# Altium schematic sheet AFE_32_SUP.SchDoc: FMC ADC 128CH 10B
size 420 x 297 mm; Author: G.Kasprowicz; CompanyName: WUT ISE; DrawnBy: G.Kasprowicz; Organization: WUT ISE; Address1: PW ISE; Address2: Nowowiejska 15/19 00-665 Warsaw; Address3: gkasprow@gmail.com; DocumentNumber: 3; Revision: 1; SheetNumber: 3; SheetTotal: 9; ModifiedBy: -; CheckedDate: -; Title2: AFE 32 SUP; DivGrp: WUT ISE; Designer: G.Kasprowicz; ModifiedDate: -; ProjectName: Sensor Box
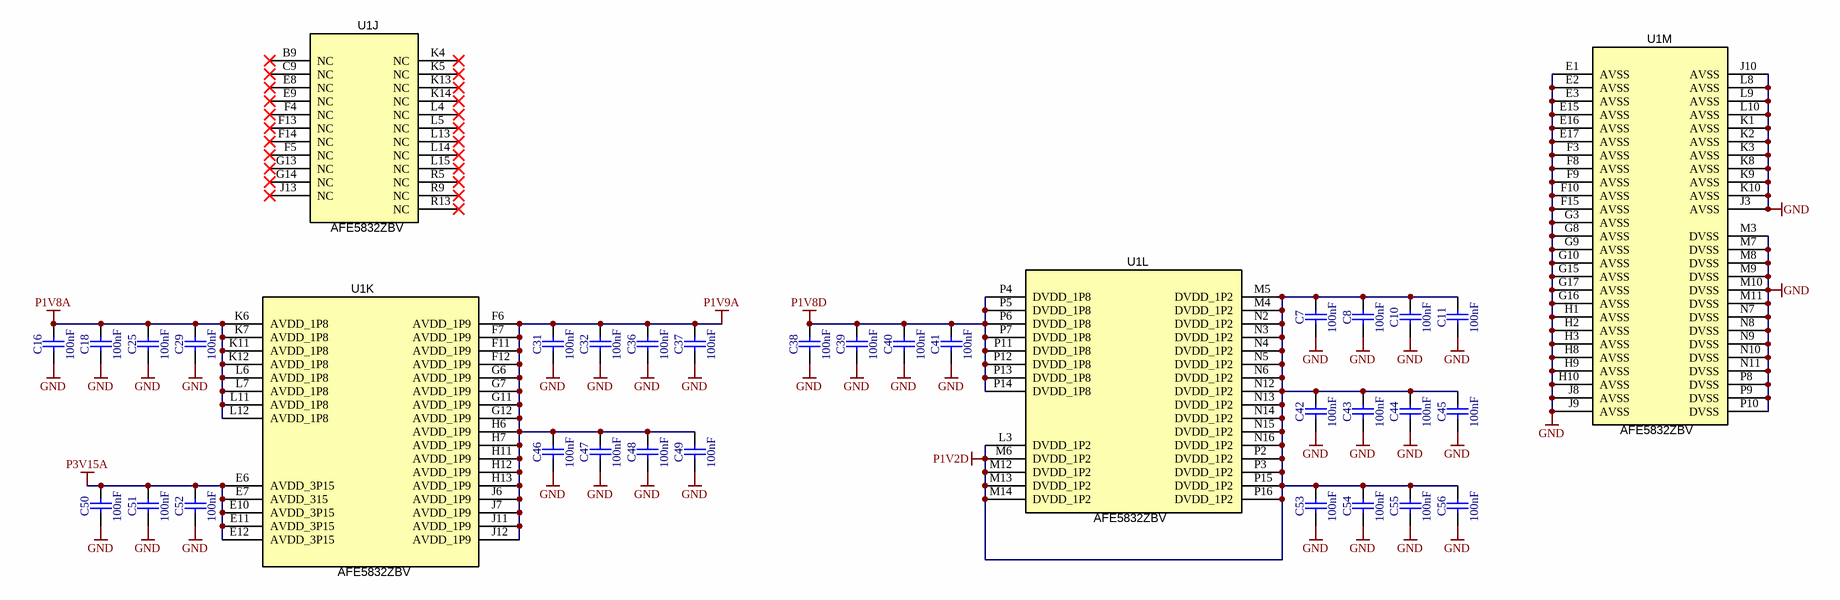
[diagram p0: AFE_32_SUP.SchDoc]

## Parts
C7  100nF  [CAPC0603X33N]
C8  100nF  [CAPC0603X33N]
C10  100nF  [CAPC0603X33N]
C11  100nF  [CAPC0603X33N]
C16  100nF  [CAPC0603X33N]
C18  100nF  [CAPC0603X33N]
C25  100nF  [CAPC0603X33N]
C29  100nF  [CAPC0603X33N]
C31  100nF  [CAPC0603X33N]
C32  100nF  [CAPC0603X33N]
C36  100nF  [CAPC0603X33N]
C37  100nF  [CAPC0603X33N]
C38  100nF  [CAPC0603X33N]
C39  100nF  [CAPC0603X33N]
C40  100nF  [CAPC0603X33N]
C41  100nF  [CAPC0603X33N]
C42  100nF  [CAPC0603X33N]
C43  100nF  [CAPC0603X33N]
C44  100nF  [CAPC0603X33N]
C45  100nF  [CAPC0603X33N]
C46  100nF  [CAPC0603X33N]
C47  100nF  [CAPC0603X33N]
C48  100nF  [CAPC0603X33N]
C49  100nF  [CAPC0603X33N]
C50  100nF  [CAPC0603X33N]
C51  100nF  [CAPC0603X33N]
C52  100nF  [CAPC0603X33N]
C53  100nF  [CAPC0603X33N]
C54  100nF  [CAPC0603X33N]
C55  100nF  [CAPC0603X33N]
C56  100nF  [CAPC0603X33N]
U1  AFE5832ZBV  [BGA289C80P17X17_1500X1500X140]  (parts J,K,L,M of 13)

## Nets
GND: C7.1 C8.1 C10.1 C11.1 C16.1 C18.1 C25.1 C29.1 C31.1 C32.1 C36.1 C37.1 C38.1 C39.1 C40.1 C41.1 C42.1 C43.1 C44.1 C45.1 C46.1 C47.1 C48.1 C49.1 C50.1 C51.1 C52.1 C53.1 C54.1 C55.1 C56.1 U1.E1(AVSS) U1.E2(AVSS) U1.E3(AVSS) U1.E15(AVSS) U1.E16(AVSS) U1.E17(AVSS) U1.F3(AVSS) U1.F8(AVSS) U1.F9(AVSS) U1.F10(AVSS) U1.F15(AVSS) U1.G3(AVSS) U1.G8(AVSS) U1.G9(AVSS) U1.G10(AVSS) U1.G15(AVSS) U1.G16(AVSS) U1.G17(AVSS) U1.H1(AVSS) U1.H2(AVSS) U1.H3(AVSS) U1.H8(AVSS) U1.H9(AVSS) U1.H10(AVSS) U1.J3(AVSS) U1.J8(AVSS) U1.J9(AVSS) U1.J10(AVSS) U1.K1(AVSS) U1.K2(AVSS) U1.K3(AVSS) U1.K8(AVSS) U1.K9(AVSS) U1.K10(AVSS) U1.L8(AVSS) U1.L9(AVSS) U1.L10(AVSS) U1.M3(DVSS) U1.M7(DVSS) U1.M8(DVSS) U1.M9(DVSS) U1.M10(DVSS) U1.M11(DVSS) U1.N7(DVSS) U1.N8(DVSS) U1.N9(DVSS) U1.N10(DVSS) U1.N11(DVSS) U1.P8(DVSS) U1.P9(DVSS) U1.P10(DVSS)
P1V2D: C7.2 C8.2 C10.2 C11.2 C42.2 C43.2 C44.2 C45.2 C53.2 C54.2 C55.2 C56.2 U1.L3(DVDD_1P2) U1.M4(DVDD_1P2) U1.M5(DVDD_1P2) U1.M6(DVDD_1P2) U1.M12(DVDD_1P2) U1.M13(DVDD_1P2) U1.M14(DVDD_1P2) U1.N2(DVDD_1P2) U1.N3(DVDD_1P2) U1.N4(DVDD_1P2) U1.N5(DVDD_1P2) U1.N6(DVDD_1P2) U1.N12(DVDD_1P2) U1.N13(DVDD_1P2) U1.N14(DVDD_1P2) U1.N15(DVDD_1P2) U1.N16(DVDD_1P2) U1.P2(DVDD_1P2) U1.P3(DVDD_1P2) U1.P15(DVDD_1P2) U1.P16(DVDD_1P2)
P1V8A: C16.2 C18.2 C25.2 C29.2 U1.K6(AVDD_1P8) U1.K7(AVDD_1P8) U1.K11(AVDD_1P8) U1.K12(AVDD_1P8) U1.L6(AVDD_1P8) U1.L7(AVDD_1P8) U1.L11(AVDD_1P8) U1.L12(AVDD_1P8)
P1V8D: C38.2 C39.2 C40.2 C41.2 U1.P4(DVDD_1P8) U1.P5(DVDD_1P8) U1.P6(DVDD_1P8) U1.P7(DVDD_1P8) U1.P11(DVDD_1P8) U1.P12(DVDD_1P8) U1.P13(DVDD_1P8) U1.P14(DVDD_1P8)
P1V9A: C31.2 C32.2 C36.2 C37.2 C46.2 C47.2 C48.2 C49.2 U1.F6(AVDD_1P9) U1.F7(AVDD_1P9) U1.F11(AVDD_1P9) U1.F12(AVDD_1P9) U1.G6(AVDD_1P9) U1.G7(AVDD_1P9) U1.G11(AVDD_1P9) U1.G12(AVDD_1P9) U1.H6(AVDD_1P9) U1.H7(AVDD_1P9) U1.H11(AVDD_1P9) U1.H12(AVDD_1P9) U1.H13(AVDD_1P9) U1.J6(AVDD_1P9) U1.J7(AVDD_1P9) U1.J11(AVDD_1P9) U1.J12(AVDD_1P9)
P3V15A: C50.2 C51.2 C52.2 U1.E6(AVDD_3P15) U1.E7(AVDD_315) U1.E10(AVDD_3P15) U1.E11(AVDD_3P15) U1.E12(AVDD_3P15)

Not connected (* = marked no-connect by the designer): U1 B9(NC)* C9(NC)* E8(NC)* E9(NC)* F4(NC)* F5(NC)* F13(NC)* F14(NC)* G13(NC)* G14(NC)* J13(NC)* K4(NC)* K5(NC)* K13(NC)* K14(NC)* L4(NC)* L5(NC)* L13(NC)* L14(NC)* L15(NC)* R5(NC)* R9(NC)* R13(NC)*

## Notes on the sheet
- Project/Equipment
- Document
- Designer
- Drawn by
- Check.by
- Copyright WUT ISE 2018.
  This documentation describes Open Hardware and is licensed under the CERN OHL v.1.1. You may redistribute and modify this documentation under the terms of the CERN OHL v.1.1. (http://ohwr.org/CERNOHL). This documentation is distributed WITHOUT ANY EXPRESS OR IMPLIED WARRANTY, INCLUDING OF MERCHANTABILITY, SATISFACTORY QUALITY AND FITNESS FOR A PARTICULAR PURPOSE. Please see the CERN OHL v.1.1 for applicable conditions.
- Contact
- File
- Last Mod.
- Print Date
- Sheet
- Size
- A3
- of
- Rev

## Library data of the parts
C7 C8 C10 C11 C16 C18 C25 C29 C31 C32 C36-C56 = CC0201_100NF_6.3V_10%_X7R: Non-polarised capacitor; Part Description: SMD Multilayer Chip Ceramic Capacitor; Manufacturer: GENERIC; Manufacturer1 Part Number: CC0201KRX7R5BB104; Voltage: 6.3V; TC: X7R; Tolerance: ±10%; Part Number: CC0201_100NF_6.3V_10%_X7R; Component Kind: Standard; Component Type: Standard; Pin Count: 2; Value: 100nF; Status: Not Recommended; Manufacturer Part Number: CC0201_100NF_6.3V_10%_X7R; Case: 0201; Mounted: Yes; Socket: No; SMD: Yes; Sense: No; Manufacturer1 Example: YAGEO PHYCOMP; Manufacturer1 ComponentHeight: 0.33mm; HelpURL: \\cern.ch\dfs\Applications\Altium\Datasheets\CC0201_X7R_YAGEO_6.3VTO50V.pdf; Author: CERN DEM BC; CreateDate: 20.11.2020; LatestRevisionDate: 20.11.2020
U1 = AFE58JD32ZBV: 32-Channel Ultrasound AFE with 41.5-mW/Channel Power, 1.5nV/√Hz Noise, 12-Bit, 40-MSPS or 10-Bit, 50-MSPS output and Passive CW Mixer, ZBV0289A (NFBGA-289); Manufacturer: Texas Instruments; SymbolCreator: Altium; SizeArea_mm2: 225; SizeAreaWB_mm2: 289; SizeX_mm: 15; SizeZ_mm: 1.8; CompType: IC; U/M: EA; SymbolVersion: 2017-06-05; PartNumber: AFE5832ZBV; PackageReference: ZBV0289A; PackageDescription: NFBGA-289; MountType: SMT; SizeY_mm: 15; ComponentLink1Description: Datasheet Link; ComponentLink1URL: https://sps06.itg.ti.com/sites/KMS/crossdivteams/altium/docs/ComponentDatasheets/AFE58JD32_Rev1.2.pdf; Publisher: Texas Instruments; LatestRevisionDate: 2017-06-06; Alternate Manufacturer: Texas Instruments